# Altium schematic sheet LCD.SchDoc
size B
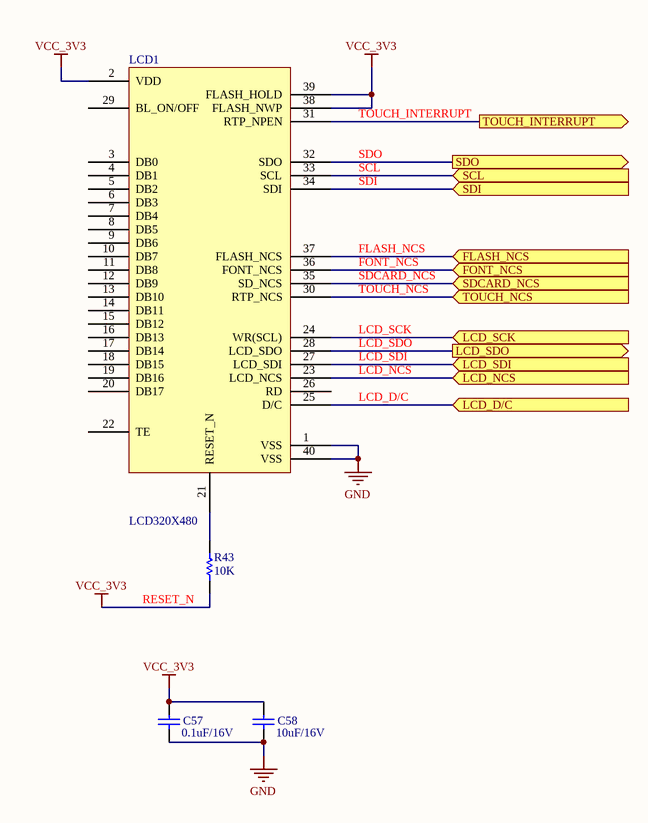
[diagram p0: LCD.SchDoc]

## Parts
C57  0.1uF/16V  [RAD-0.3]
C58  10uF/16V  [RAD-0.3]
LCD1  LCD320X480
R43  10K  [AXIAL-0.3]

## Ports
FLASH_NCS (in), FONT_NCS (in), LCD_D/C (in), LCD_NCS (in), LCD_SCK (in), LCD_SDI (in), LCD_SDO (out), SCL (in), SDCARD_NCS (in), SDI (in), SDO (out), TOUCH_INTERRUPT (out), TOUCH_NCS (in)

## Nets
GND: C57.1 C58.1 LCD1.1(VSS) LCD1.40(VSS)
RESET_N: C57.2 C58.2 LCD1.2(VDD) LCD1.38(FLASH_NWP) LCD1.39(FLASH_HOLD) R43.1  [also labelled VCC_3V3]
FLASH_NCS: LCD1.37(FLASH_NCS) ; port FLASH_NCS
FONT_NCS: LCD1.36(FONT_NCS) ; port FONT_NCS
LCD_D/C: LCD1.25(D/C) ; port LCD_D/C
LCD_NCS: LCD1.23(LCD_NCS) ; port LCD_NCS
LCD_SCK: LCD1.24(WR(SCL)) ; port LCD_SCK
LCD_SDI: LCD1.27(LCD_SDI) ; port LCD_SDI
LCD_SDO: LCD1.28(LCD_SDO) ; port LCD_SDO
SCL: LCD1.33(SCL) ; port SCL
SDCARD_NCS: LCD1.35(SD_NCS) ; port SDCARD_NCS
SDI: LCD1.34(SDI) ; port SDI
SDO: LCD1.32(SDO) ; port SDO
TOUCH_INTERRUPT: LCD1.31(RTP_NPEN) ; port TOUCH_INTERRUPT
TOUCH_NCS: LCD1.30(RTP_NCS) ; port TOUCH_NCS
NetLCD1_21: LCD1.21(RESET_N) R43.2

Not connected (* = marked no-connect by the designer): LCD1 3(DB0) 4(DB1) 5(DB2) 6(DB3) 7(DB4) 8(DB5) 9(DB6) 10(DB7) 11(DB8) 12(DB9) 13(DB10) 14(DB11) 15(DB12) 16(DB13) 17(DB14) 18(DB15) 19(DB16) 20(DB17) 22(TE) 26(RD) 29(BL_ON/OFF)

## Library data of the parts
C57 C58 = Cap: Capacitor; Published: 8-Jun-2000; LatestRevisionDate: 17-Jul-2002; LatestRevisionNote: Re-released for DXP Platform.; PackageReference: RAD-0.3; Publisher: Altium Limited; PackageDescription: Radial Cap, Thru-Hole; 2 Leads; 0.3 in Pin Spacing
  C57: Value: 0.1uF/16V
  C58: Value: 10uF/16V
LCD1 = ER-TFTM035-6
R43 = Res1: Resistor; Published: 8-Jun-2000; LatestRevisionDate: 17-Jul-2002; LatestRevisionNote: Re-released for DXP Platform.; PackageReference: AXIAL-0.3; Publisher: Altium Limited; PackageDescription: Axial Device, Thru-Hole; 2 Leads; 0.3 in Pin Spacing; Value: 10K